# Altium schematic sheet inputs.SchDoc
size B; SheetNumber: 3; SheetTotal: 3
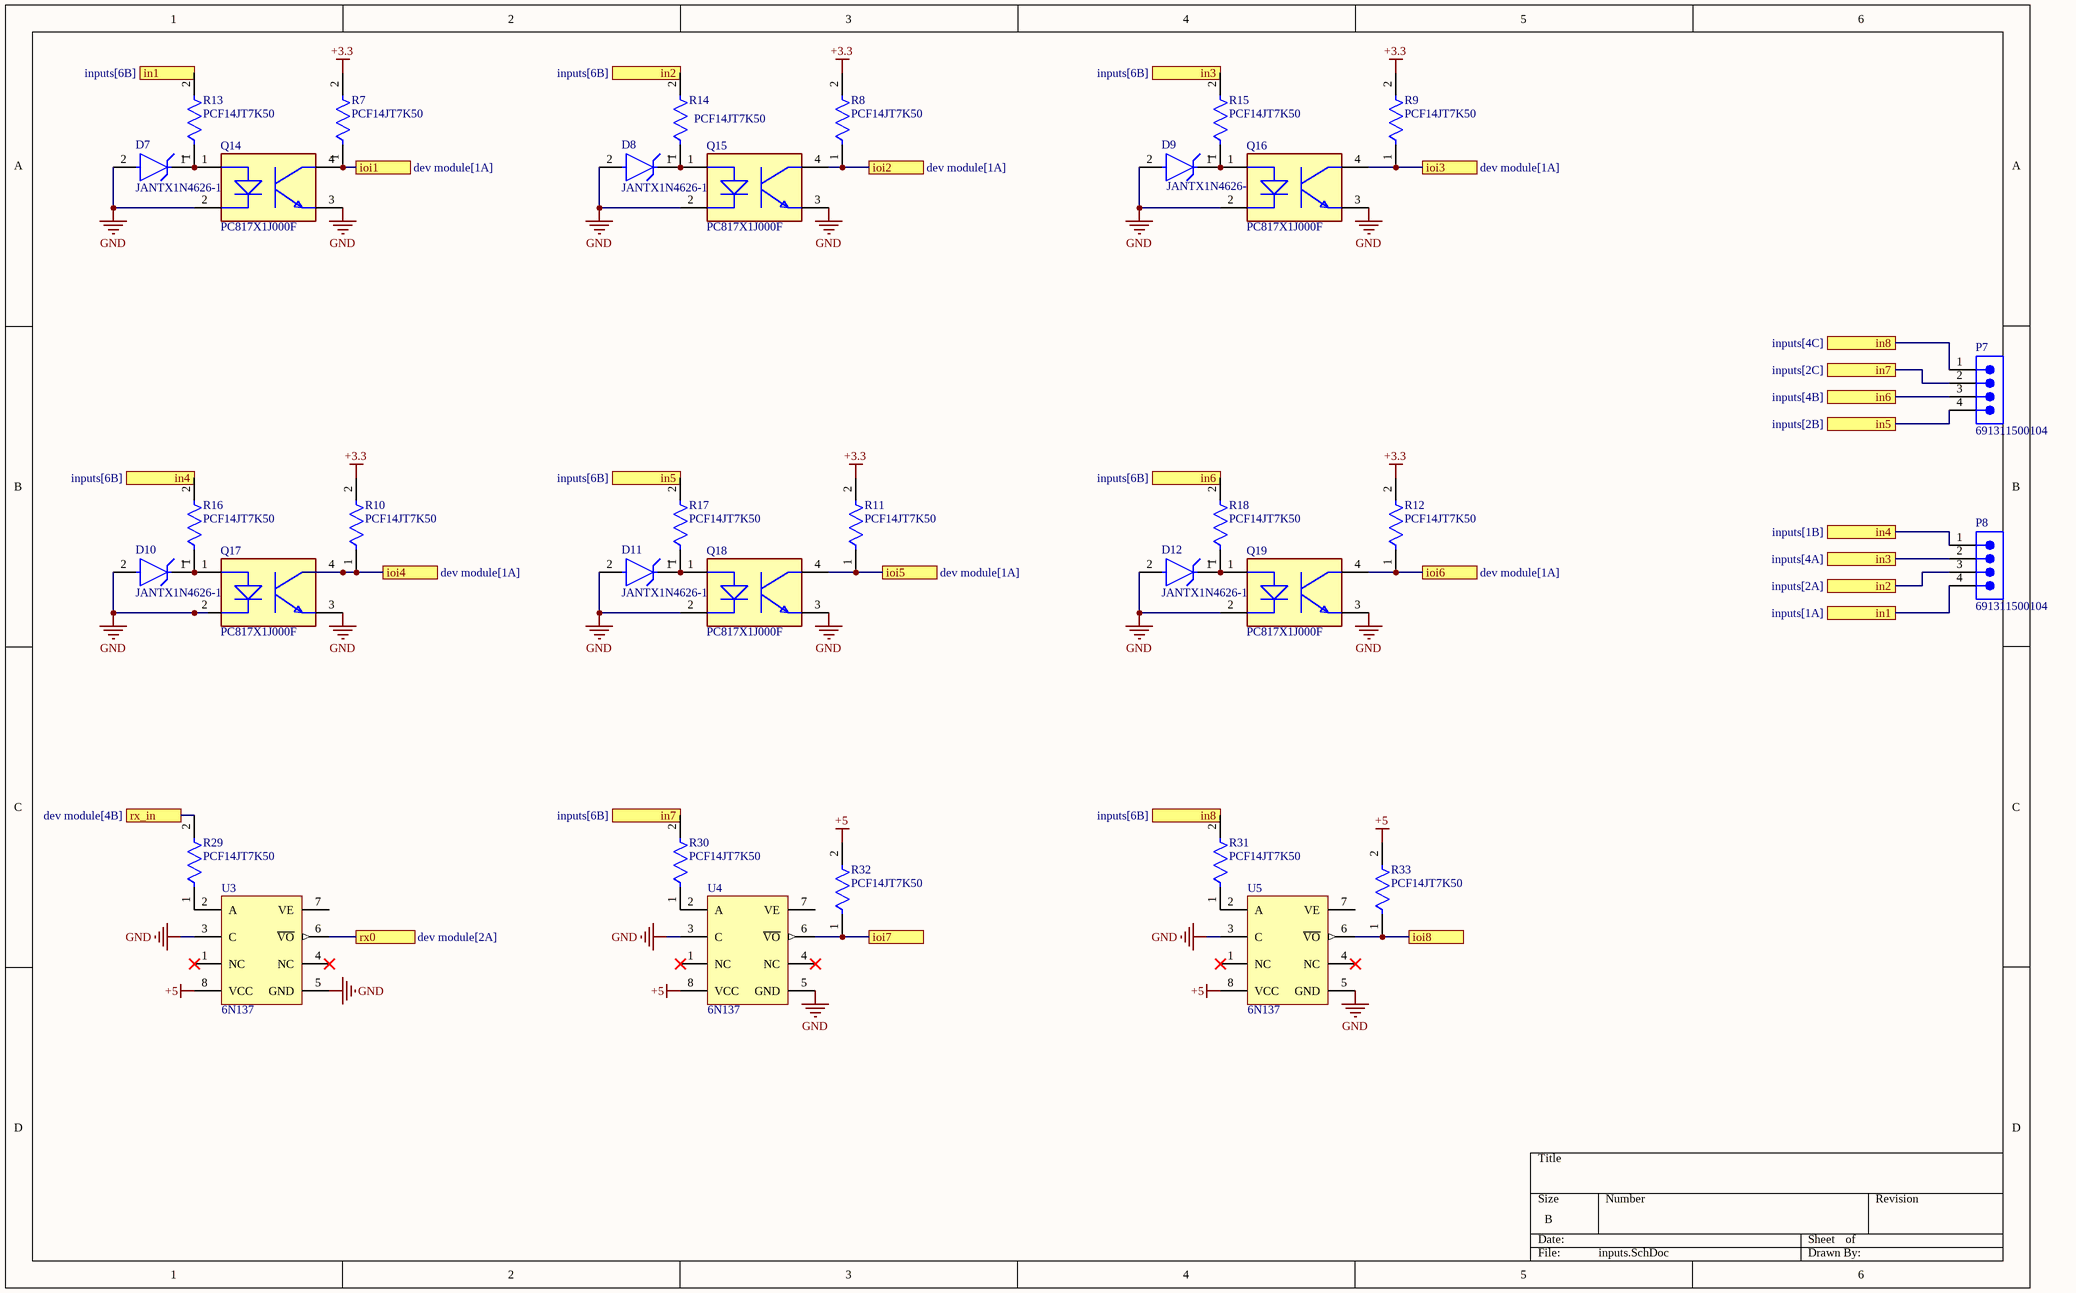
[diagram p0: inputs.SchDoc]

## Parts
D7  JANTX1N4626-1  [FP-DO-35-MFG]
D8  JANTX1N4626-1  [FP-DO-35-MFG]
D9  JANTX1N4626-1  [FP-DO-35-MFG]
D10  JANTX1N4626-1  [FP-DO-35-MFG]
D11  JANTX1N4626-1  [FP-DO-35-MFG]
D12  JANTX1N4626-1  [FP-DO-35-MFG]
P7  691311500104  [691311500104]
P8  691311500104  [691311500104]
Q14  PC817X1J000F  [FP-PC817X1J000F-MFG]
Q15  PC817X1J000F  [FP-PC817X1J000F-MFG]
Q16  PC817X1J000F  [FP-PC817X1J000F-MFG]
Q17  PC817X1J000F  [FP-PC817X1J000F-MFG]
Q18  PC817X1J000F  [FP-PC817X1J000F-MFG]
Q19  PC817X1J000F  [FP-PC817X1J000F-MFG]
R7  PCF14JT7K50  [FP-CF14-MFG]
R8  PCF14JT7K50  [FP-CF14-MFG]
R9  PCF14JT7K50  [FP-CF14-MFG]
R10  PCF14JT7K50  [FP-CF14-MFG]
R11  PCF14JT7K50  [FP-CF14-MFG]
R12  PCF14JT7K50  [FP-CF14-MFG]
R13  PCF14JT7K50  [FP-CF14-MFG]
R14  PCF14JT7K50  [FP-CF14-MFG]
R15  PCF14JT7K50  [FP-CF14-MFG]
R16  PCF14JT7K50  [FP-CF14-MFG]
R17  PCF14JT7K50  [FP-CF14-MFG]
R18  PCF14JT7K50  [FP-CF14-MFG]
R29  PCF14JT7K50  [FP-CF14-MFG]
R30  PCF14JT7K50  [FP-CF14-MFG]
R31  PCF14JT7K50  [FP-CF14-MFG]
R32  PCF14JT7K50  [FP-CF14-MFG]
R33  PCF14JT7K50  [FP-CF14-MFG]
U3  6N137  [VISH-DIP-8_A]
U4  6N137  [VISH-DIP-8_A]
U5  6N137  [VISH-DIP-8_A]

## Ports
in1 (see inputs[1A]), in1 (see inputs[6B]), in2 (see inputs[2A]), in2 (see inputs[6B]), in3 (see inputs[4A]), in3 (see inputs[6B]), in4 (see inputs[1B]), in4 (see inputs[6B]), in5 (see inputs[2B]), in5 (see inputs[6B]), in6 (see inputs[4B]), in6 (see inputs[6B]), in7 (see inputs[2C]), in7 (see inputs[6B]), in8 (see inputs[4C]), in8 (see inputs[6B]), ioi1 (see dev module[1A]), ioi2 (see dev module[1A]), ioi3 (see dev module[1A]), ioi4 (see dev module[1A]), ioi5 (see dev module[1A]), ioi6 (see dev module[1A]), ioi7, ioi8, rx0 (see dev module[2A]), rx_in (see dev module[4B])

## Nets
+3.3: R7.2 R8.2 R9.2 R10.2 R11.2 R12.2
+5: R32.2 R33.2 U3.8(VCC) U4.8(VCC) U5.8(VCC)
GND: D7.2(A) D8.2(A) D9.2(A) D10.2(A) D11.2(A) D12.2(A) Q14.2(C) Q14.3(E) Q15.2(C) Q15.3(E) Q16.2(C) Q16.3(E) Q17.2(C) Q17.3(E) Q18.2(C) Q18.3(E) Q19.2(C) Q19.3(E) U3.3(C) U3.5(GND) U4.3(C) U4.5(GND) U5.3(C) U5.5(GND)
in1: P8.4 R13.2 ; port in1
in2: P8.3 R14.2 ; port in2
in3: P8.2 R15.2 ; port in3
in4: P8.1 R16.2 ; port in4
in5: P7.4 R17.2 ; port in5
in6: P7.3 R18.2 ; port in6
in7: P7.2 R30.2 ; port in7
in8: P7.1 R31.2 ; port in8
ioi1: Q14.4(C) R7.1 ; port ioi1
ioi2: Q15.4(C) R8.1 ; port ioi2
ioi3: Q16.4(C) R9.1 ; port ioi3
ioi4: Q17.4(C) R10.1 ; port ioi4
ioi5: Q18.4(C) R11.1 ; port ioi5
ioi6: Q19.4(C) R12.1 ; port ioi6
ioi7: R32.1 U4.6(~{VO}) ; port ioi7
ioi8: R33.1 U5.6(~{VO}) ; port ioi8
rx0: U3.6(~{VO}) ; port rx0
rx_in: R29.2 ; port rx_in
NetD7_1: D7.1(C) Q14.1(A) R13.1
NetD8_1: D8.1(C) Q15.1(A) R14.1
NetD9_1: D9.1(C) Q16.1(A) R15.1
NetD10_1: D10.1(C) Q17.1(A) R16.1
NetD11_1: D11.1(C) Q18.1(A) R17.1
NetD12_1: D12.1(C) Q19.1(A) R18.1
NetR29_1: R29.1 U3.2(A)
NetR30_1: R30.1 U4.2(A)
NetR31_1: R31.1 U5.2(A)

Not connected (* = marked no-connect by the designer): U3 1(NC)* 4(NC)* 7(VE); U4 1(NC)* 4(NC)* 7(VE); U5 1(NC)* 4(NC)* 7(VE)

## Library data of the parts
D7-D12 = CMP-00252-10349970-1: JANTX1N4626-1 Metallurgically Bonded Glass Zener Diode 5.6V 500mW 5% 2-Pin DO-204AH; Impedance: 1.4kΩ; Element Configuration: Single; Max Reverse Leakage Current: 10µA; Test Current: 250µA; Power Dissipation: 480mW; Mount: Through Hole; Max Operating Temperature: 175°C; Min Operating Temperature: -65°C; Max Power Dissipation: 500mW; Tolerance: 5%; Voltage Tolerance: 5%; Lifecycle Status: Production; Number of Pins: 2; RoHS: Compliant; Schedule B: 8541100050, 8541100050; Lead Free: Contains Lead; Zener Voltage: 5.6V; NexarPartId: 10349970; Radiation Hardening: No
P7 P8 = CMP-1502-02148-2: NexarPartId: 8917749; Pitch: 5.08mm; Number of Positions Per Level: 4; Gender: Male; Voltage: 300V; Current: 20A; Number of Levels: 1; Orientation: Vertical; Number of Pins: 4; Mount: Through Hole; Number of Contacts: 4; Length: 8.5mm; Number of Rows: 1; Contact Plating: Tin; Color: Green; Termination: Solder; Contact Material: Brass; REACH SVHC: Unknown; RoHS: Compliant; Lead Pitch: 5.08mm; Width: 22.32mm; Height: 12mm; Packaging: Box
Q14-Q19 = CMP-65434-000003-1: OPTOISOLATOR 5KV TRANS 4DIP; Collector Emitter Saturation Voltage: 200mV; Forward Voltage: 1.4V; Power Dissipation: 200mW; Input Current: 20mA; Max Collector Current: 50mA; Collector Emitter Breakdown Voltage: 80V; Rise Time: 18000ns; Number of Elements: 1; Reverse Breakdown Voltage: 6V; Current Transfer Ratio: 600%; Min Operating Temperature: -30°C; Number of Pins: 4; Radiation Hardening: No; Output Current per Channel: 50mA; Case/Package: DIP; Fall Time: 18000ns; Forward Current: 50mA; Isolation Voltage: 5kV; Package Quantity: 2000; Max Operating Temperature: 100°C; Packaging: Sleeve; Max Input Current: 50mA; Output Voltage: 80V; Max Power Dissipation: 200mW; Mount: Through Hole; Number of Channels: 1; Collector Emitter Voltage (VCEO): 80V
R7-R18 R29-R33 = CMP-26528-000003-1: RES 7.5K OHM 1/4W 5% AXIAL; Max Power Dissipation: 250mW; Temperature Coefficient: -400ppm/°C; Resistance: 7.5kR; RoHS Compliant: Yes; Lead Free: Lead Free; Max Operating Temperature: 155°C; Case/Package: Axial; Tolerance: 5%; Power Rating: 250mW; Diameter: 2.3mm; Features: Flame Retardant Coating; Series: CF; Resistor Type: Carbon Film; Number of Terminations: 2; Length: 0.256inch; Min Operating Temperature: -55°C; Contact Plating: Tin; Packaging: Tape and Reel; Mount: Through Hole; Radiation Hardening: No
U3-U5 = CMP-2000-05669-1: High Speed Optocoupler, Single and Dual, 10 MBd, 5 V, -40 to 100 degC, 8-Pin DIP, RoHS, Tube; Manufacturer: Vishay; No. of Channels: 1Channel; Isolation Voltage: 5.3kV; Data Rate: 10Mbaud; SVHC: ToBeAdvised; No. of Pins: 8Pins; Package Description: 8-Pin Double In-line Package, Body 10.16 x 6.7 mm, Pitch 2.54 mm; Manufacturer URL: http://www.vishay.com/; Product Range: -; Optocoupler Case Style: DIP; Mounting Technology: ThroughHole; Packaging: Each; Package Reference: DIP-8; Datasheet Version: Rev. 1.9, 03/2015; Datasheet URL: http://www.vishay.com/docs/84732/6n137.pdf